# Altium schematic sheet VisualOutput.SchDoc
size A; SheetNumber: 3; SheetTotal: 4
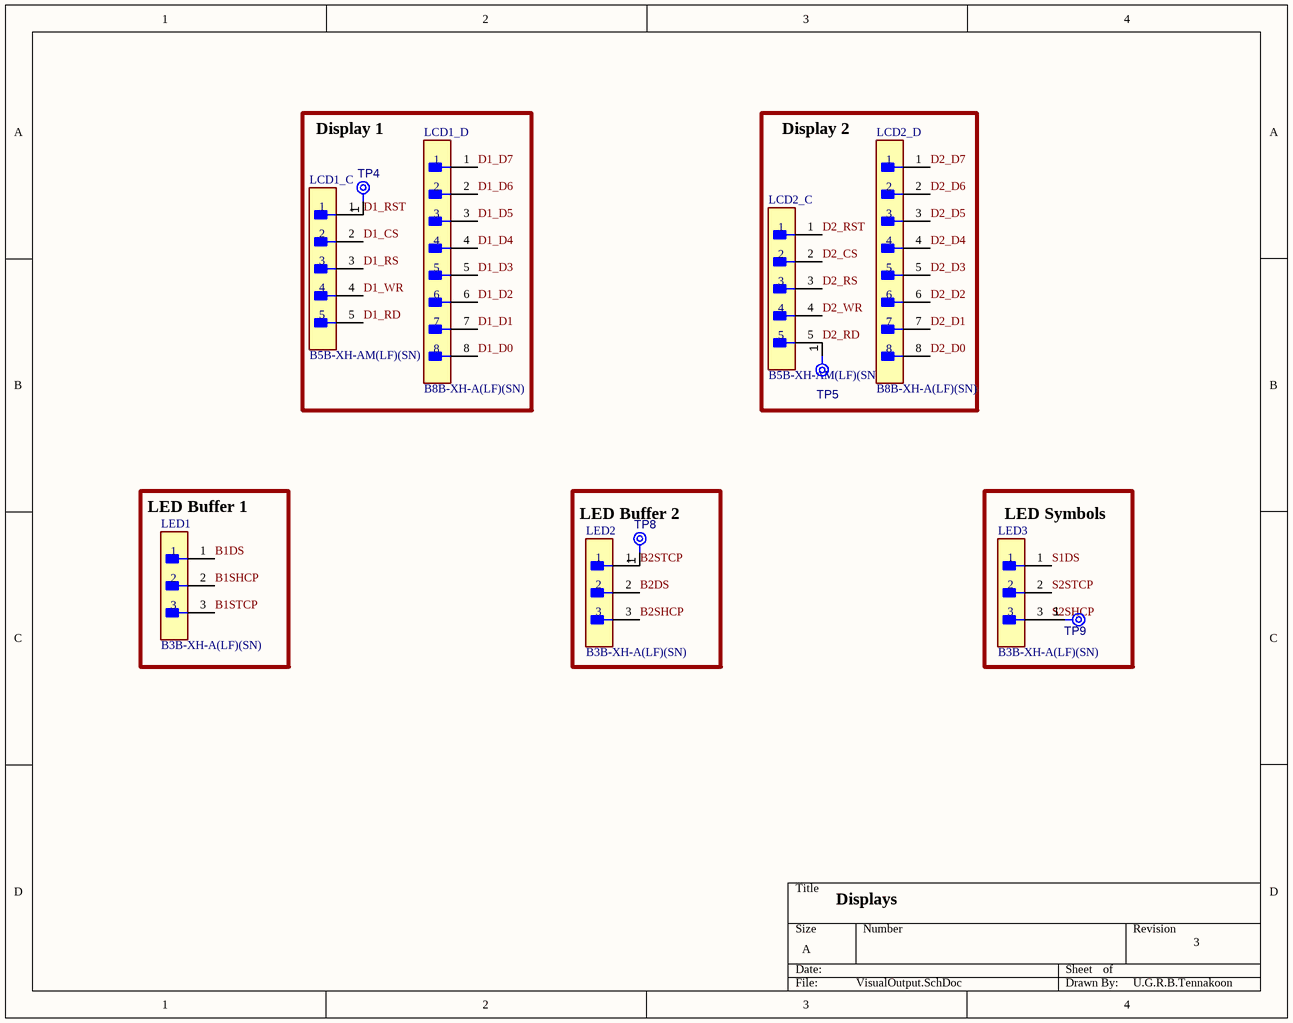
[diagram p0: VisualOutput.SchDoc]

## Parts
LCD1_C  B5B-XH-AM(LF)(SN)  [FP-B5B-XH-AM_LF_SN-MFG]  (no BOM)
LCD1_D  B8B-XH-A(LF)(SN)  [FP-B8B-XH-A_LF_SN-MFG]  (no BOM)
LCD2_C  B5B-XH-AM(LF)(SN)  [FP-B5B-XH-AM_LF_SN-MFG]  (no BOM)
LCD2_D  B8B-XH-A(LF)(SN)  [FP-B8B-XH-A_LF_SN-MFG]  (no BOM)
LED1  B3B-XH-A(LF)(SN)  [FP-B3B-XH-A_LF_SN-MFG]  (no BOM)
LED2  B3B-XH-A(LF)(SN)  [FP-B3B-XH-A_LF_SN-MFG]  (no BOM)
LED3  B3B-XH-A(LF)(SN)  [FP-B3B-XH-A_LF_SN-MFG]  (no BOM)
TP4  TPAD6R  [TP06R]  (value not drawn)  (no BOM)
TP5  TPAD6R  [TP06R]  (value not drawn)  (no BOM)
TP8  TPAD6R  [TP06R]  (value not drawn)  (no BOM)
TP9  TPAD6R  [TP06R]  (value not drawn)  (no BOM)

## Nets
B1DS: LED1.1
B1SHCP: LED1.2
B1STCP: LED1.3
B2DS: LED2.2
B2SHCP: LED2.3
B2STCP: LED2.1 TP8.1(TP)
D1_CS: LCD1_C.2
D1_D0: LCD1_D.8
D1_D1: LCD1_D.7
D1_D2: LCD1_D.6
D1_D3: LCD1_D.5
D1_D4: LCD1_D.4
D1_D5: LCD1_D.3
D1_D6: LCD1_D.2
D1_D7: LCD1_D.1
D1_RD: LCD1_C.5
D1_RS: LCD1_C.3
D1_RST: LCD1_C.1 TP4.1(TP)
D1_WR: LCD1_C.4
D2_CS: LCD2_C.2
D2_D0: LCD2_D.8
D2_D1: LCD2_D.7
D2_D2: LCD2_D.6
D2_D3: LCD2_D.5
D2_D4: LCD2_D.4
D2_D5: LCD2_D.3
D2_D6: LCD2_D.2
D2_D7: LCD2_D.1
D2_RD: LCD2_C.5 TP5.1(TP)
D2_RS: LCD2_C.3
D2_RST: LCD2_C.1
D2_WR: LCD2_C.4
S1DS: LED3.1
S2SHCP: LED3.3 TP9.1(TP)
S2STCP: LED3.2

## Notes on the sheet
- (near LCD1_D) Display 1
- (near LCD2_D) Display 2
- (near LED1) LED Buffer 1
- (near TP8) LED Buffer 2
- (near LED3) LED Symbols
- Displays
- 3
- U.G.R.B.Tennakoon

## Library data of the parts
LCD1_C LCD2_C = CMP-17439-000304-1: CONN HEADER VERT 5POS 2.5MM; Mated Stacking Heights: 9.8mm; Voltage Rating: 250V; Max Current Rating: 3A; Number of Positions: 5; Contact Resistance: 20mR; Depth: 5.75mm; Connector Type: Header; Color: Green; Insulation Material: Nylon; Contact Plating: Copper; Length: 14.9mm; Fastening Type: Detent; Contact Material: Brass; Number of Rows: 1; Contact Type: Male Pin; Housing Material: Polyamide; Housing Color: White; Lead Free: Lead Free; Max Voltage Rating (AC): 250V; Mount: Through Hole; Contact Shape: Square; Min Operating Temperature: -25°C; Packaging: Bulk; Orientation: Straight; Insulation Color: Natural; Series: XH; Flammability Rating: UL94 V-0; Contact Finish - Mating: TIN; Max Operating Temperature: 85°C; Termination: Solder; Pitch: 2.5mm
LCD1_D LCD2_D = CMP-17438-000015-1: CONN HEADER VERT 8POS 2.5MM; Voltage Rating (AC): 250V; Insulation Resistance: 1GR; Connector Type: Male Pin; Max Current Rating: 3A; Wire/Cable Gauge: 22AWG; Number of Contacts: 8; Contact Resistance: 20mR; Orientation: Straight; Pitch: 2.5mm; Min Operating Temperature: -25°C; Number of Rows: 1; Contact Type: Male Pin; Packaging: Bulk; Lead Free: Lead Free; Max Operating Temperature: 85°C; Housing Material: Polyamide; Voltage Rating: 250V; Series: XH; Mount: Through Hole; Depth: 5.75mm; Contact Material: Brass; Fastening Type: Detent; Color: Natural; Max Voltage Rating (AC): 250V; Number of Positions: 8; Housing Color: White; Contact Plating: Tin; Lead Pitch: 2.5mm; Length: 22.4mm; REACH SVHC: No SVHC; Termination: Press-Fit; Current Rating: 3A
LED1-LED3 = CMP-17439-000014-3: CONN HEADER VERT 3POS 2.5MM; Max Voltage Rating (DC): 250V; Number of Positions: 3; Current Rating: 3A; Color: Natural; Gender: Male; Wire/Cable Gauge: 22AWG; Contact Resistance: 20mR; Insulation Resistance: 1GR; Insulation Material: Nylon; Contact Plating: Tin; Depth: 5.75mm; Contact Type: Male Pin; Max Operating Temperature: 85°C; Insulation Color: Natural; Voltage Rating (AC): 250V; Connector Type: Header; Orientation: Straight; Fastening Type: Detent; Housing Color: White; Min Operating Temperature: -25°C; Termination: Solder; Voltage Rating: 250V; Series: XH; Pitch: 2.5mm; Contact Shape: Square; Number of Rows: 1; Lead Free: Lead Free; Packaging: Bulk; Mount: Through Hole; Flammability Rating: UL94 V-0; Max Voltage Rating (AC): 250V; REACH SVHC: No SVHC; Housing Material: Polyamide; Contact Material: Brass; Lead Pitch: 2.5mm; Contact Finish - Mating: TIN; Length: 9.9mm; Max Current Rating: 3A; Number of Contacts: 3
TP4 TP5 TP8 TP9 = CMP-00028-00002-3: 0.6mm round; Pins: 1